# EAGLE design Controler 2_25 (EAGLE 9.0.0)
CNAME: Franks FlightSim Boards; CPROJECT: Franks FlightSim Boards; CREVISION: v0.1; DESIGNER: Frank van Ierland
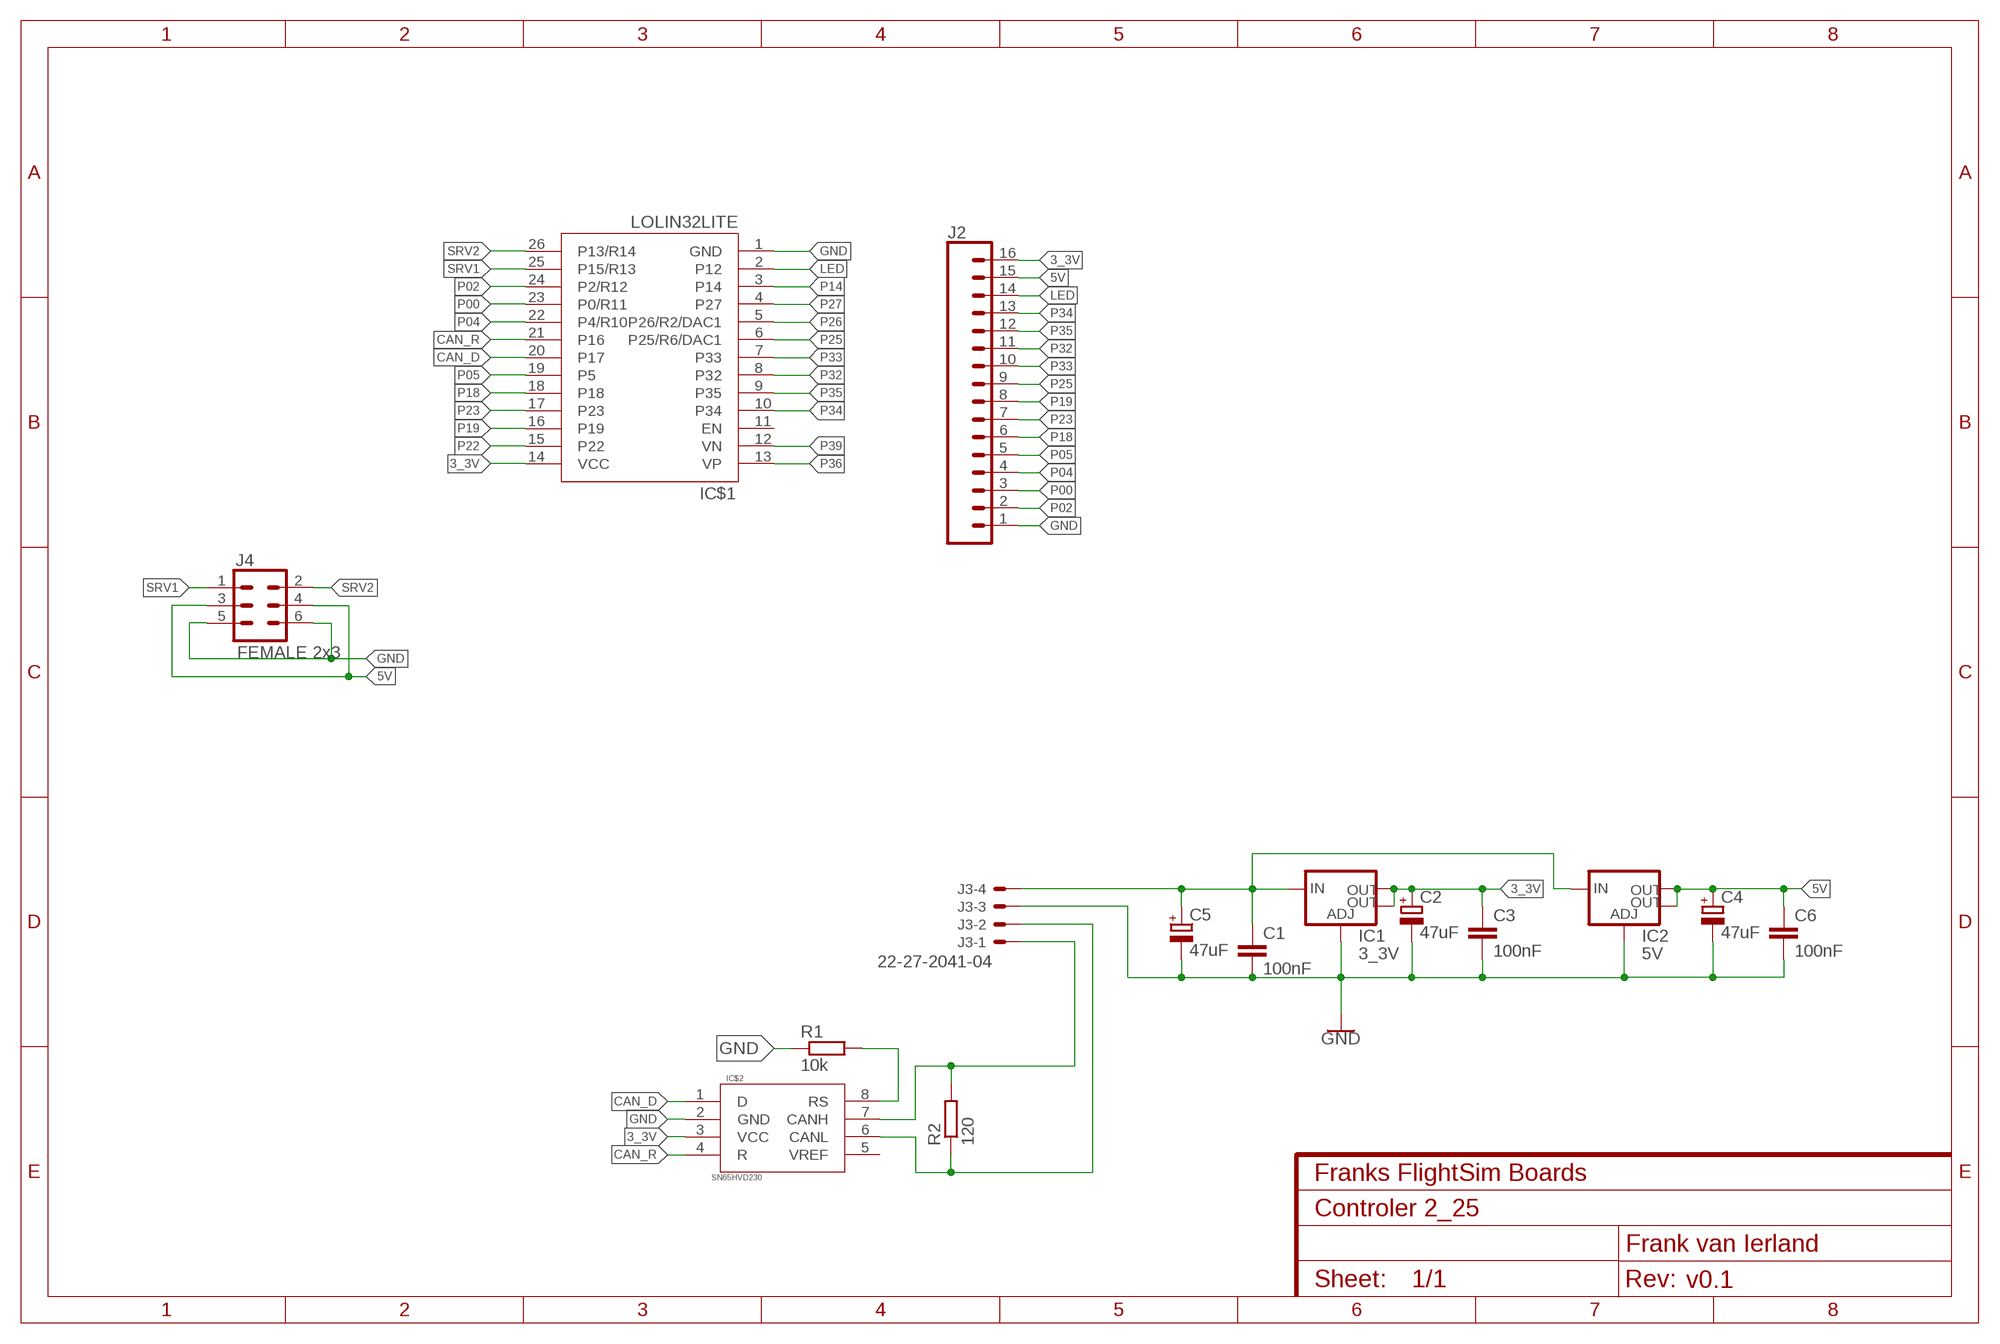
[diagram p0: schematic, sheet 1]

## Parts
C1  100nF  C-EUC1206  [C1206]
C2  47uF  CPOL-EUCT3528  [CT3528]
C3  100nF  C-EUC1206  [C1206]
C4  47uF  CPOL-EUCT3528  [CT3528]
C5  47uF  CPOL-EU153CLV-0605  [153CLV-0605]
C6  100nF  C-EUC1206  [C1206]
IC1  3_3V  V_REG_LM1117SOT223  [SOT223]
IC2  5V  V_REG_LM1117SOT223  [SOT223]
IC$1  LOLIN32LITE  [LOLIN32LITE]
IC$2  SN65HVD230  [SO08]
J2  CONN_16  [1X16]
J3  22-27-2041-04  [6410-04]
J4  FEMALE 2x3  CONN_03X2FEMALE  [2X3]
R1  10k  R-EU_M1206  [M1206]
R2  120  R-EU_R1210  [R1210]

## Nets
3_3V [3_3V]: C2.-(+) C3.1 IC1.2(OUT) IC1.4(OUT) IC$1.14(VCC) IC$2.3(VCC) J2.16
5V [5V]: C4.-(+) C6.1 IC2.2(OUT) IC2.4(OUT) J2.15 J4.3 J4.4
12V [12V]: C1.1 C5.+ IC1.3(IN) IC2.3(IN) J3.4
CAN_D: IC$1.20(P17) IC$2.1(D)
CAN_R: IC$1.21(P16) IC$2.4(R)
GND [GND]: C1.2 C2.+(-) C3.2 C4.+(-) C5.- C6.2 IC1.1(ADJ) IC2.1(ADJ) IC$1.1(GND) IC$2.2(GND) J2.1 J3.3 J4.5 J4.6 R1.1
LED [LED]: IC$1.2(P12) J2.14
N$1: IC$2.8(RS) R1.2
N$2: IC$2.7(CANH) J3.1 R2.2
N$3: IC$2.6(CANL) J3.2 R2.1
P00: IC$1.23(P0/R11) J2.3
P02: IC$1.24(P2/R12) J2.2
P04: IC$1.22(P4/R10) J2.4
P05: IC$1.19(P5) J2.5
P14: IC$1.3(P14)
P18: IC$1.18 J2.6
P19: IC$1.16(P19) J2.8
P22: IC$1.15(P22)
P23: IC$1.17(P23) J2.7
P25: IC$1.6(P25/R6/DAC1) J2.9
P26: IC$1.5(P26/R2/DAC1)
P27: IC$1.4(P27)
P32: IC$1.8(P32) J2.11
P33: IC$1.7(P33) J2.10
P34: IC$1.10(P34) J2.13
P35: IC$1.9(P35) J2.12
P36: IC$1.13(VP)
P39: IC$1.12(VN)
SRV1: IC$1.25(P15/R13) J4.1
SRV2: IC$1.26(P13/R14) J4.2
Unconnected: IC$1.11(EN) IC$2.5(VREF)

## Library data of the parts
C1 C3 C6 = resistor:C-EU: CAPACITOR, European symbol
C2 C4 C5 = resistor:CPOL-EU: POLARIZED CAPACITOR, European symbol
IC1 IC2 = SparkFun-IC-Power:V_REG_LM1117: Voltage Regulator LM1117 Standard adjustable voltage regulator but in SMD form. Spark Fun Electronics SKU : COM-00595; PROD_ID: VREG-08170
IC$1 = Franks:LOLIN32LITE
IC$2 = Franks:SN65HVD230
J2 = SparkFun-Connectors:CONN_16: Multi connection point. Often used as Generic Header-pin footprint for 0.1 inch spaced/style header connections On any of the 0.1 inch spaced packages, you can populate with these: Break Away Headers - Straight <https://www.sparkfun.com/products/116> (PRT-00116) Break Away Male Headers - Right Angle <https://www.sparkfun.com/products/553> (PRT-00553) Female Headers <https://www.sparkfun.com/products/115> (PRT-00115) Break Away Headers - Machine Pin <https://www.sparkfun.com/products/117> (PRT-00117) Break Away Female Headers - Swiss Machine Pin <https://www.sparkfun.com/products/743> (PRT-00743) For SCREWTERMINALS and SPRING TERMINALS visit here: Screw Terimnals on SparkFun.com <https://www.sparkfun.com/search/results?term=Screw+Terminals> (5mm/3.5mm/2.54mm spacing) This device is also useful as a general connection point to wire up your design to another part of your project. Our various solder wires solder well into these plated through hole pads. Hook-Up Wire - Assortment (Stranded, 22 AWG) <https://www.sparkfun.com/products/11375> (PRT-11375) Hook-Up Wire - Assortment (Solid Core, 22 AWG) <https://www.sparkfun.com/products/11367> (PRT-11367) View the entire wire category on our website here <https://www.sparkfun.com/categories/141> Special notes: Molex polarized connector foot print use with SKU : PRT-08231 with associated crimp pins and housings. 1MM SMD Version SKU: PRT-10208 NOTES ON THE VARIANTS LOCK and LOCK_LONGPADS... This footprint was designed to help hold the alignment of a through-hole component (i.e. 6-pin header) while soldering it into place. You may notice that each hole has been shifted either up or down by 0.005 of an inch from it's more standard position (which is a perfectly straight line). This slight alteration caused the pins (the squares in the middle) to touch the edges of the holes. Because they are alternating, it causes a "brace" to hold the component in place. 0.005 has proven to be the perfect amount of "off-center" position when using our standard breakaway headers. Although looks a little odd when you look at the bare footprint, once you have a header in there, the alteration is very hard to notice. Also,if you push a header all the way into place, it is covered up entirely on the bottom side.
J3 = con-molex:22-?-04: CONNECTOR wire to board 2.54 mm (.1 inch) pitch header; MF: MOLEX; OC_FARNELL: unknown; OC_NEWARK: unknown
J4 = SparkFun-Connectors:CONN_03X2: Multi connection point. Often used as Generic Header-pin footprint for 0.1 inch spaced/style header connections You can populate with any combo of single row headers, but if you'd like an exact match, check these: Header - 2x3 (Male, 0.1") <https://www.sparkfun.com/products/12807> (PRT-12807) Header - 2x3 (Female, 0.1") <https://www.sparkfun.com/products/13010> (PRT-13010) 2x3 Pin Shrouded Header <https://www.sparkfun.com/products/10877> (PRT-10877) On any of the 0.1 inch spaced packages, you can populate with these: Break Away Headers - Straight <https://www.sparkfun.com/products/116> (PRT-00116) Break Away Male Headers - Right Angle <https://www.sparkfun.com/products/553> (PRT-00553) Female Headers <https://www.sparkfun.com/products/115> (PRT-00115) Break Away Headers - Machine Pin <https://www.sparkfun.com/products/117> (PRT-00117) Break Away Female Headers - Swiss Machine Pin <https://www.sparkfun.com/products/743> (PRT-00743) Special note: the shrouded connector mates well with our 3x2 ribbon cables: Ribbon Crimp Connector - 6-pin (2x3, Female) <https://www.sparkfun.com/products/10651> (PRT-10651) Ribbon Cable - 6 wire (15ft) <https://www.sparkfun.com/products/10646> (PRT-10646); PROD_ID: CONN-11566
R1 R2 = resistor:R-EU_: RESISTOR, European symbol

## Net classes
1 GND: width 0.508 mm, clearance 0.254 mm
2 12V: width 0.762 mm
3 3_3V: width 0.508 mm
4 5V: width 0.508 mm
5 LED: width 0.254 mm

## Board
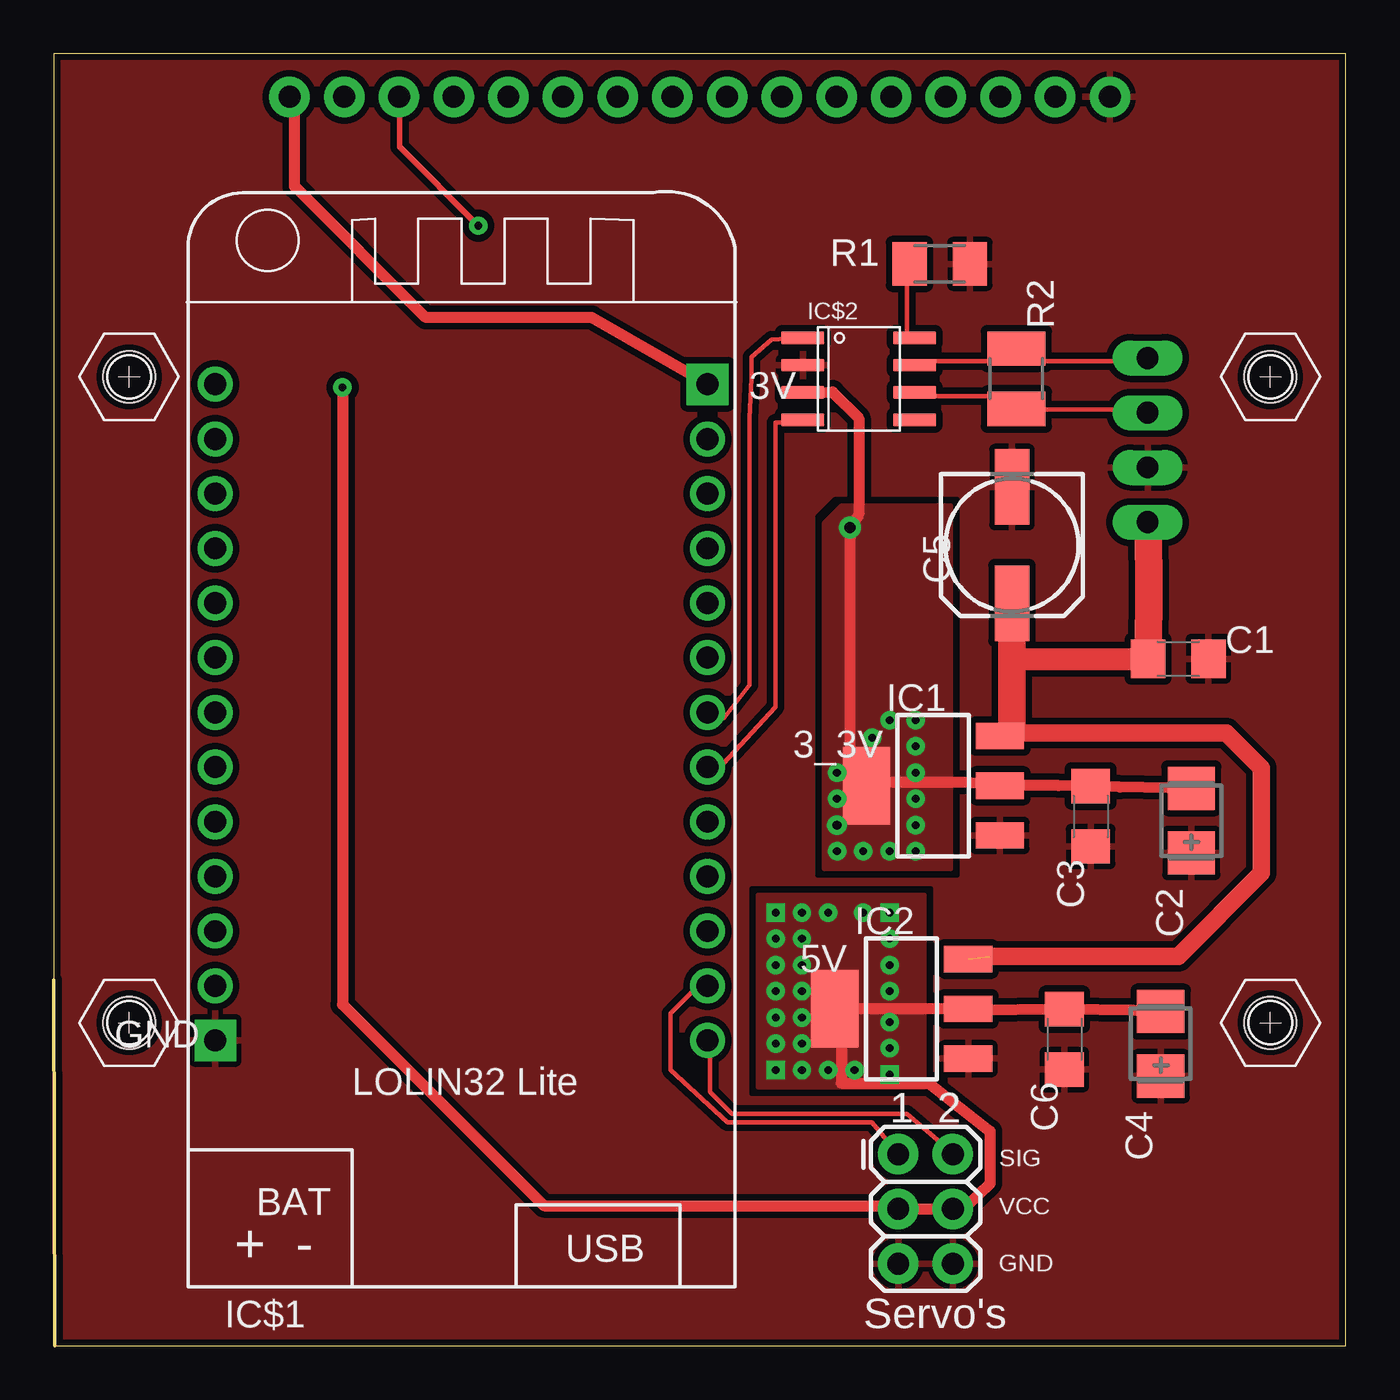
[diagram p1: board, top side]
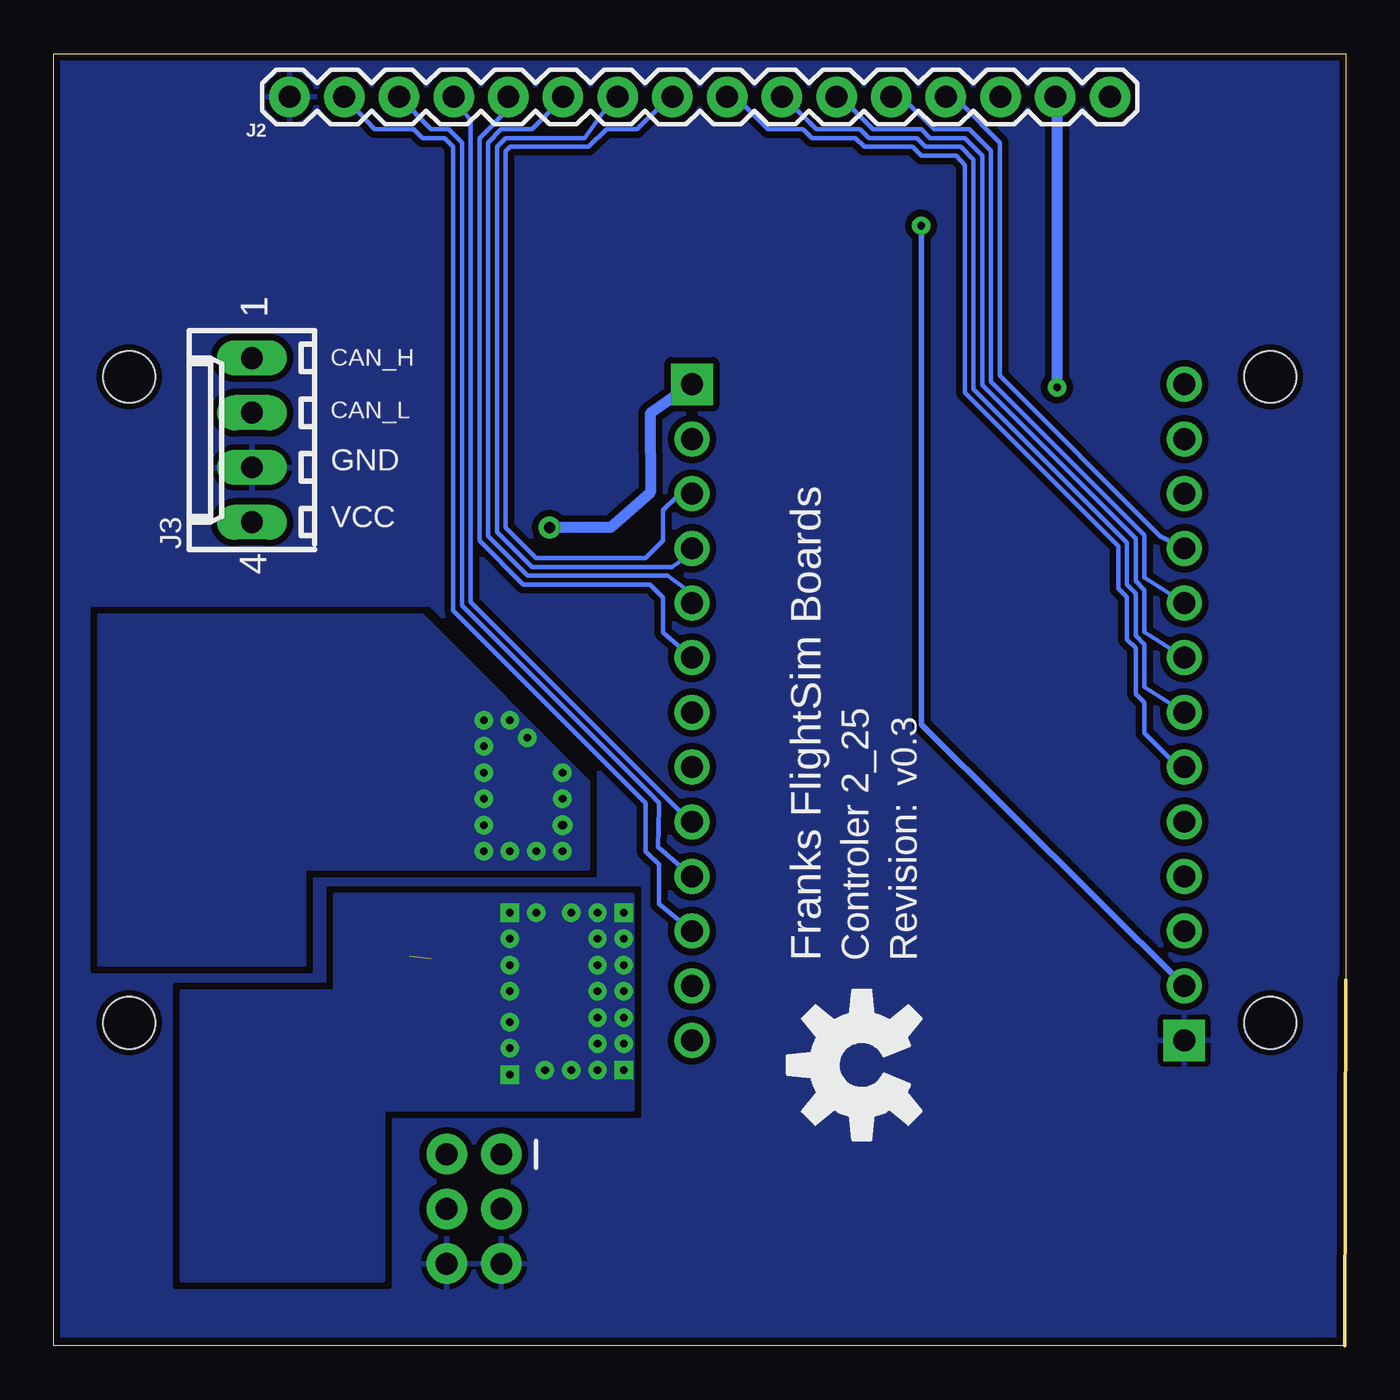
[diagram p2: board, bottom side, seen from below]

Size 60 x 60 mm. Coordinates in mm from the lower left corner, seen from the top.
Outline: 0,17 0.04,0
Outline: 0,0 60,0 60,60 0,60 0,0
Copper layers (1*16): Top 0.035mm / dielectric 1.5mm / Bottom 0.035mm
Design rules "SparkFun": minimum track width 8mil, minimum drill 20mil, track to track 8mil, track to pad 8mil, pad to pad 8mil, via to via 8mil, smd to smd 8mil, copper to edge 10mil, drill to drill 8mil, minimum pad ring 12mil, minimum via ring 10mil, stop-mask expansion 4mil, vias tented up to drill 25mil, thermal gap 10mil

### Footprints (pad centres in the part's own frame; a part is rotated, then mirrored left to right if it is on the bottom)
C1206 = smd 1.6 x 1.8: 1 -1.4,0; 2 1.4,0
CT3528 = smd 2 x 2.2: + -1.5,0; - 1.5,0
153CLV-0605 = smd 3.5 x 1.6: + 2.7,0; - -2.7,0
SOT223 = smd 1.219 x 2.235: 1 -2.311,-3.099; 2 0,-3.099; 3 2.311,-3.099 | smd 3.6 x 2.2: 4 0,3.099
LOLIN32LITE = drill 1.016 pad 1.93 square: 1 -11.43,-10.16; 14 11.43,20.32 | drill 1.016: 2 -11.43,-7.62; 3 -11.43,-5.08; 4 -11.43,-2.54; 5 -11.43,0; 6 -11.43,2.54; 7 -11.43,5.08; 8 -11.43,7.62; 9 -11.43,10.16; 10 -11.43,12.7; 11 -11.43,15.24; 12 -11.43,17.78; 13 -11.43,20.32; 15 11.43,17.78; 16 11.43,15.24; 17 11.43,12.7; 18 11.43,10.16; 19 11.43,7.62; 20 11.43,5.08; 21 11.43,2.54; 22 11.43,0; 23 11.43,-2.54; 24 11.43,-5.08; 25 11.43,-7.62; 26 11.43,-10.16
SO08 = smd 2 x 0.6: 1 -2.6,1.905; 2 -2.6,0.635; 3 -2.6,-0.635; 4 -2.6,-1.905; 5 2.6,-1.905; 6 2.6,-0.635; 7 2.6,0.635; 8 2.6,1.905
1X16 = drill 1.016 pad 1.88: 1 0,0; 2 2.54,0; 3 5.08,0; 4 7.62,0; 5 10.16,0; 6 12.7,0; 7 15.24,0; 8 17.78,0; 9 20.32,0; 10 22.86,0; 11 25.4,0; 12 27.94,0; 13 30.48,0; 14 33.02,0; 15 35.56,0; 16 38.1,0
6410-04 = drill 1.016 long: 1 3.81,0; 2 1.27,0; 3 -1.27,0; 4 -3.81,0
2X3 = drill 1.016 pad 1.88: 1 0,0; 2 0,2.54; 3 2.54,0; 4 2.54,2.54; 5 5.08,0; 6 5.08,2.54
M1206 = smd 1.6 x 2: 1 -1.4,0; 2 1.4,0
R1210 = smd 1.6 x 2.7: 1 -1.4,0; 2 1.4,0
M2.0_SW4.0_HOLE = hole 2.4: 0,0

### Placement (x,y rotation side)
C1  52.22,31.9 0 top
C2  52.83,24.38 90 top
C3  48.16,24.59 270 top
C4  51.41,14.02 90 top
C5  44.5,37.19 270 top
C6  46.94,14.22 270 top
IC1  40.84,26.01 90 top
IC2  39.37,15.65 90 top
IC$1  18.93,24.33 0 top
IC$2  37.39,44.91 0 top
J2  49.05,58 0 bottom
J3  50.8,42.06 90 bottom
J4  39.22,8.89 270 top
R1  41.15,50.24 180 top
R2  44.7,44.91 90 top
U$1  [M2.0_SW4.0_HOLE]  3.5,45 0 top
U$2  [M2.0_SW4.0_HOLE]  3.5,15 0 top
U$3  [M2.0_SW4.0_HOLE]  56.5,15 0 top
U$4  [M2.0_SW4.0_HOLE]  56.5,45 0 top
U$10  [OSHW-LOGO-L]  22.47,13.04 90 bottom

### Tracks (layer width: path | path; a pad name or v marks a point on that pad's centre or on a via)
3_3V  (via drill 0.35, 0.4, 0.51)
  Top 0.508: IC$1.14 24.98,47.75 17.27,47.75 11.18,53.85 11.18,57.71 J2.16 | 36.98,26.16 v36.98,38 37.39,38.61 37.39,43.08 36.17,44.3 IC$2.3 | 36.98,26.16 IC1.4 | C2.- 49.52,25.94 C3.1 46.67,26.01 IC1.2 42.37,26.16 36.98,26.16
  Bottom 0.508: IC$1.14 32.31,43.28 32.29,39.62 34.14,38 v36.98,38
  other vias: 36.37,22.96 36.37,24.18 37.59,22.96 38.81,22.96 40.03,22.96 40.03,24.18 40.03,27.84 40.03,29.06 36.37,25.4 36.37,26.62 38,28.24 38.81,29.06 40.03,26.62 40.03,25.4
  pour Top (isolate 0.254, no thermals): 41.66,22.15 35.76,22.15 35.76,38.2 36.58,39.01 41.66,39.01
  pour Bottom (no thermals): 35.15,22.15 35.15,26.21 42.88,33.93 57.91,33.93 57.91,17.68 48.36,17.68 48.36,22.15
5V  (via drill 0.35)
  Top 0.508: C4.- 50.13,15.58 C6.1 42.53,15.58 IC2.2 IC2.4 36.58,15.54 36.58,12.19 40.64,12.19 43.48,9.96 43.48,7.52 42.42,6.5 J4.4 J4.3 38.61,6.5 22.76,6.5 13.41,15.85 v13.41,44.5
  Bottom 0.508: J2.15 13.41,57.51 v13.41,44.5
  other vias: 34.75,12.8 33.53,12.8 33.53,14.02 33.53,16.46 33.53,20.12 33.53,18.9 33.53,17.68 33.53,15.24 35.97,20.12 37.59,20.12 38.81,20.12 38.81,18.9 38.81,17.68 38.81,16.46 38.81,15.04 38.81,13.82 38.81,12.6 34.75,18.9 34.75,20.12 34.75,17.68 34.75,16.46 34.75,15.24 34.75,14.02 35.97,12.8 37.19,12.8
  pour Top (no thermals): 40.44,11.99 32.72,11.99 32.72,20.93 40.44,20.93
  pour Bottom: 33.12,20.93 46.94,20.93 46.94,16.46 54.05,16.46 54.05,3.05 44.7,3.05 44.7,10.97 33.12,10.97
12V  (1 unrouted)
  Top 0.813: IC1.3 45.11,28.45 54.46,28.45 56.08,26.82 56.08,21.95 52.22,18.09 43.48,18.09
  Top 1.016: 44.5,31.9 C1.1 | 44.5,28.45 IC1.3
  Top 1.27: C5.+ 44.5,31.9 44.5,28.45 | C1.1 50.85,34.34 50.87,35.9 J3.4
CAN_D
  Top 0.203: IC$2.1 33.33,46.74 32.41,45.92 32.41,44.91 32.31,43.08 32.31,30.68 31.12,29.15 IC$1.20
CAN_R
  Top 0.203: IC$2.4 33.85,42.88 33.53,42.88 33.53,29.67 31.09,27.03 IC$1.21
GND
  pour Bottom (isolate 0.305, rank 2): 0,60 0.08,17.94 0,17.94 0,0.51 60,0.51 60,60
  pour Top (isolate 0.305, rank 2): 0.08,59.97 0.08,22.94 0,17 0,0 59.96,0 59.96,17.59 59.89,37.98 60,60
LED  (via drill 0.35)
  Top 0.254: J2.14 16.05,57.1 16.05,55.68 v19.71,52.02
  Bottom 0.254: v19.71,52.02 19.71,28.85 IC$1.2
N$1
  Top 0.203: R1.2 39.62,49.99 39.62,46.94 IC$2.8
N$2
  Top 0.203: IC$2.7 40.44,45.72 43.89,45.72 44.12,45.74 44.14,45.74 R2.2 45.72,45.72 49.78,45.72 J3.1
N$3
  Top 0.203: IC$2.6 40.23,44.3 40.44,44.09 43.48,44.09 43.51,44.12 44.05,44.12 R2.1 45.92,43.48 49.78,43.48 J3.2
P00
  Bottom 0.203: J2.3 42.47,56.49 41.66,56.49 41.05,55.88 41.05,34.38 32.31,25.64 31.9,25.2 31.9,24.99 31.93,23.16 IC$1.23
P02
  Bottom 0.203: J2.2 45.11,56.49 43.28,56.49 42.88,56.08 41.86,56.08 41.45,55.68 41.45,34.14 32.51,25.2 32.51,22.96 31.9,22.35 31.9,20.52 IC$1.24
P04
  Bottom 0.203: IC$1.22 30.89,24.79 40.64,34.54 40.64,56.9 J2.4
P05
  Bottom 0.203: J2.5 39.01,57.3 40.23,56.08 40.23,37.39 38.2,35.36 32.31,35.36 31.7,34.75 31.7,33.12 IC$1.19
P18
  Bottom 0.203: J2.6 36.37,57.91 37.8,56.49 39.22,56.49 39.83,55.88 39.83,37.59 38,35.76 31.5,35.76 30.68,35.15 IC$1.18
P19
  Bottom 0.203: J2.8 31.9,57.51 32.92,56.49 34.34,56.49 35.15,55.68 38.81,55.68 39.01,55.47 39.01,38 37.59,36.58 32.51,36.58 31.7,37.39 31.7,38.81 31.09,39.42 IC$1.16
P23
  Bottom 0.203: J2.7 34.34,57.51 35.36,56.08 39.01,56.08 39.42,55.68 39.42,37.8 37.8,36.17 31.29,36.17 30.68,36.58 IC$1.17
P25
  Bottom 0.203: IC$1.6 8.13,27.23 9.35,28.45 9.35,29.87 9.75,30.28 9.75,32.4 10.16,32.8 10.16,34.77 10.57,35.17 10.57,37.14 17.7,44.27 17.7,54.82 18.09,55.27 19.71,55.27 20.12,55.68 22.35,55.68 22.76,56.08 24.79,56.08 25.2,56.49 26.82,56.49 28.04,57.71 J2.9
P32
  Bottom 0.203: IC$1.8 9.35,33.14 9.35,35.11 9.75,35.51 9.75,37.48 16.88,44.61 16.88,55.26 17.68,56.08 19.3,56.08 19.71,56.49 21.95,56.49 22.96,57.51 J2.11
P33
  Bottom 0.203: IC$1.7 9.35,30.6 9.35,32.57 9.75,32.97 9.75,34.94 10.16,35.34 10.16,37.31 17.29,44.44 17.29,55.09 17.88,55.68 19.51,55.68 19.91,56.08 22.15,56.08 22.55,56.49 24.59,56.49 25.6,57.51 J2.10
P34
  Bottom 0.203: IC$1.10 8.64,37.59 16.07,45.05 16.05,55.88 17.88,57.71 J2.13
P35
  Bottom 0.203: IC$1.9 9.35,35.68 9.35,37.65 16.48,44.77 16.48,55.49 17.48,56.49 19.1,56.49 20.32,57.71 J2.12
SRV1
  Top 0.203: IC$1.25 29.67,16.46 28.65,15.44 28.65,12.8 31.29,10.36 38,10.36 J4.1
SRV2
  Top 0.203: J4.2 41.05,9.55 39.62,10.77 31.5,10.77 30.48,11.79 30.48,13.41 IC$1.26

### Text on the board
tNames: 1 2 | SIG | VCC | GND | Servo's
bNames: CAN_H | CAN_L | GND | VCC | Revision: